# EAGLE design MySens-GWeasyRS485-Nano-V10-004 (EAGLE 7.3.0)
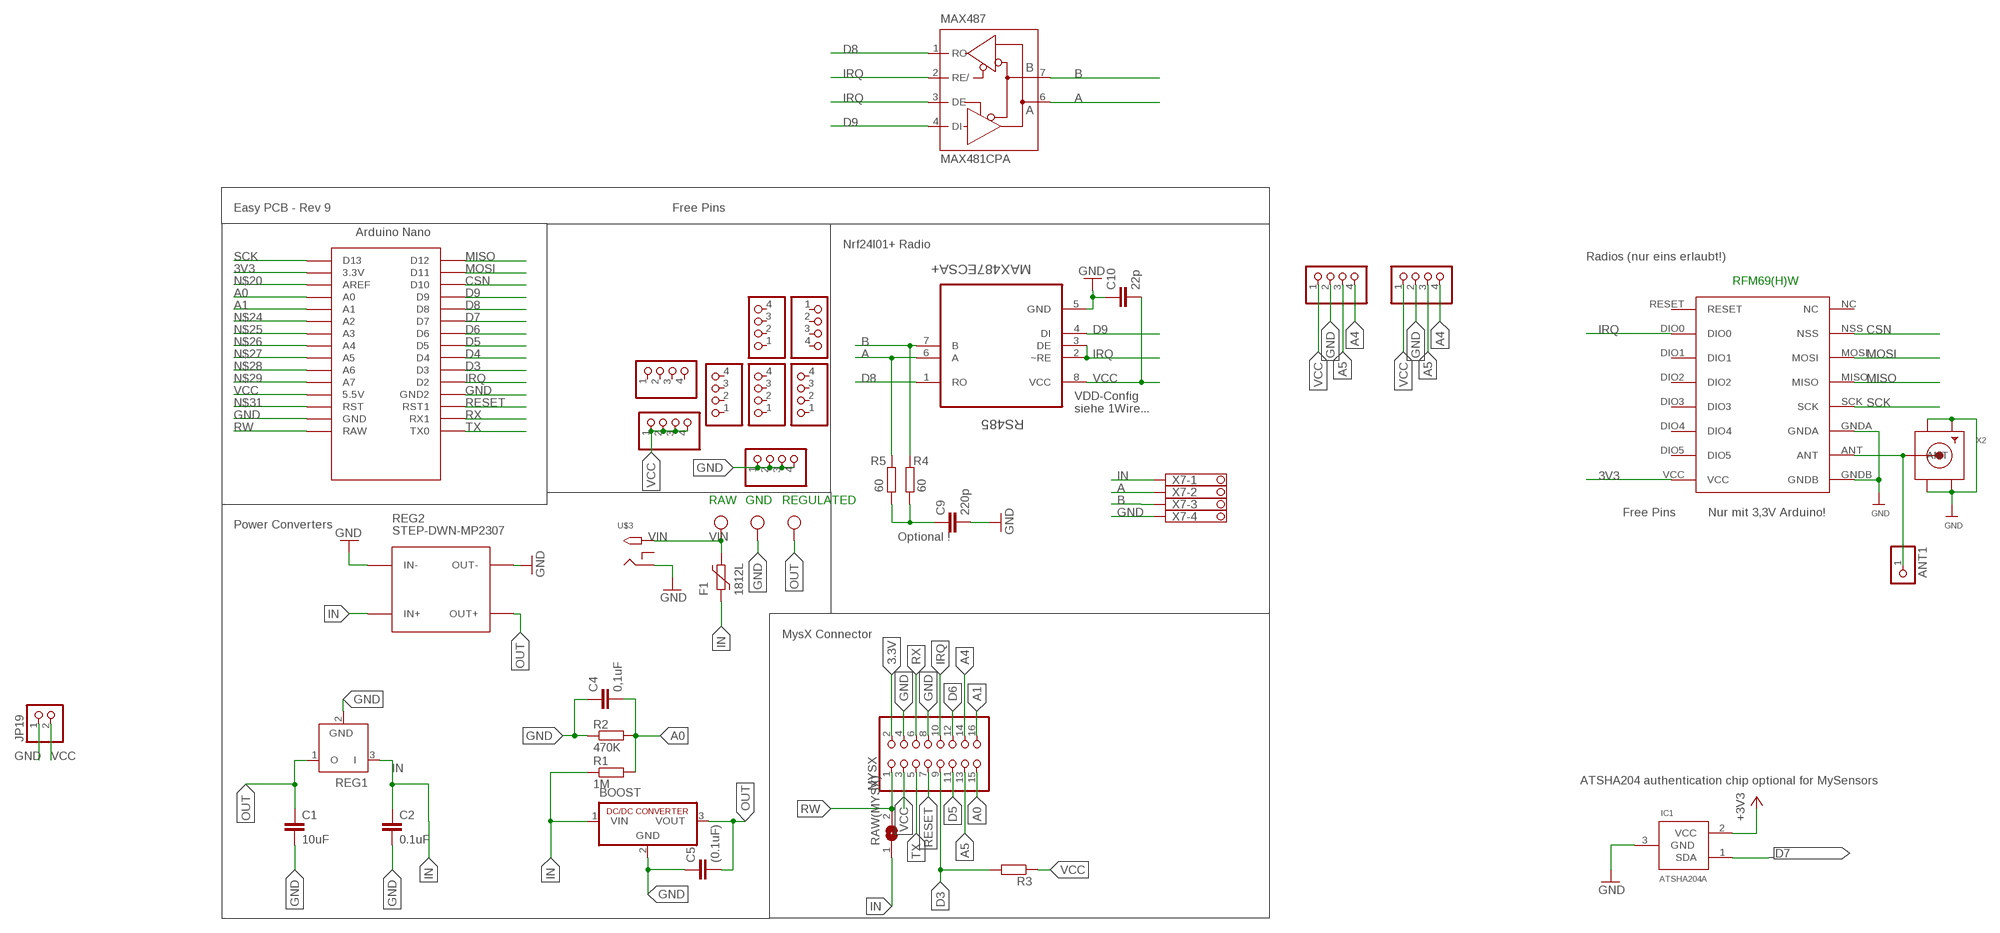
[diagram p0: schematic, sheet 1]

## Parts
ANT1  PINHD-1X1  [1X01]
BOOST  R-78C1.8-1.0  [SIP3]
C1  10uF  C-EUC1210  [C1210]
C2  0.1uF  C-EUC1206  [C1206]
C4  0,1uF  C-EUC1206  [C1206]
C5  (0.1uF)  C-EUC1206  [C1206]
C9  220p  C-EUC0805  [C0805]
C10  22p  C-EUC0805  [C0805]
F1  1812L  [1812L]
IC1  ATSHA204A  [SOT23]
JP1  PINHD-1X04_2.54-S  [1X04-S]
JP3  PINHD-1X04_2.54-S  [1X04-S]
JP6  PINHD-1X04_2.54-S  [1X04-S]
JP10  PINHD-1X04_2.54-S  [1X04-S]
JP11  PINHD-1X04_2.54-S  [1X04-S]
JP12  PINHD-1X04_2.54-S  [1X04-S]
JP13  PINHD-1X04_2.54-S  [1X04-S]
JP14  PINHD-1X04_2.54-S  [1X04-S]
JP15  PINHD-1X04_2.54-S  [1X04-S]
JP16  PINHD-1X04_2.54-S  [1X04-S]
JP19  PINHD-1X2  [1X02]
MAX487  MAX481CPA  [DIL08]
MYSX  PINHD-2X08_2.54  [2X08]
R1  1M  R-EU_R0805  [R0805]
R2  470K  R-EU_R0805  [R0805]
R3  R-EU_R0805  [R0805]
R4  60  R-EU_R0805  [R0805]
R5  60  R-EU_R0805  [R0805]
RAW(MYSX)  SJ  [SJ]
REG1  LP2950Z  [TO92]
REG2  STEP-DWN-MP2307  DC-DC-STEP-DOWN-MP2307  [DC-DC-STEP-DOWN-MP2307]
REGULATED  W237-103  [W237-103]
RFM69W  RFM69HW  [RFM]
RS485  MAX487ECSA+  [SOIC127P600X175-8N]
U$2  NANO  [NANO]
U$3  2.1MMJACKTHM  [PJ-102A]
X2  SMACONNECTOR_EDGE  [SMA_EDGELAUNCH]
X7  1751264  [1751264]

## Nets
3.3V [Power]: IC1.2(VCC) MYSX.2 ; supply symbol labelled +3V3
3V3: RFM69W.VCC U$2.3.3V
A: MAX487.6(A) R5.2 RS485.6(A) X7.2
A0: C4.2 MYSX.15 R1.2 R2.2 U$2.A0
A1: MYSX.16 U$2.A1
A4: JP6.4 JP10.4 MYSX.14
A5: JP6.3 JP10.3 MYSX.13
B: MAX487.7(B) R4.2 RS485.7(B) X7.3
CSN: RFM69W.NSS U$2.D10
D3: MYSX.9 R3.2 U$2.D3
D4: U$2.D4
D5: MYSX.11 U$2.D5
D6: MYSX.12 U$2.D6
D7: IC1.1(SDA) U$2.D7
D8: MAX487.1(RO) RS485.1(RO) U$2.D8
D9: MAX487.4(DI) RS485.4(DI) U$2.D9
GND [Power]: BOOST.2(GND) C1.2 C2.2 C4.1 C5.1 C9.2 C10.1 IC1.3(GND) JP1.1 JP1.2 JP1.3 JP1.4 JP6.2 JP10.2 JP19.1 MYSX.4 MYSX.8 R2.1 REG1.2(GND) REG2.IN- REG2.OUT- REGULATED.2 RFM69W.GNDA RFM69W.GNDB RS485.5(GND) U$2.GND U$2.GND1(GND2) U$3.RING X2.GND@1(GND4) X2.GND@2(GND3) X2.GND@3(GND2) X2.GND@4(GND1) X7.4
IN [Power]: BOOST.1(VIN) C2.1 F1.P$1 R1.1 RAW(MYSX).1 REG1.3(I) REG2.IN+ X7.1
IRQ: MAX487.2(RE/) MAX487.3(DE) MYSX.10 RFM69W.DIO0 RS485.2(~RE) RS485.3(DE) U$2.D2
MISO: RFM69W.MISO U$2.D12
MOSI: RFM69W.MOSI U$2.D11
N$16: ANT1.1 RFM69W.ANT X2.P(ANT)
N$20: U$2.AREF
N$21: C9.1 R4.1 R5.1
N$24: U$2.A2
N$25: U$2.A3
N$26: U$2.A4
N$27: U$2.A5
N$28: U$2.A6
N$29: U$2.A7
N$31: U$2.RST
OUT [Power]: BOOST.3(VOUT) C1.1 C5.2 REG1.1(O) REG2.OUT+ REGULATED.1
RESET: MYSX.7 U$2.RST1
RW: MYSX.1 RAW(MYSX).2 U$2.RAW
RX: MYSX.6 U$2.RX1
SCK: RFM69W.SCK U$2.D13
TX: MYSX.5 U$2.TX0
VCC [Power]: C10.2 JP3.1 JP3.2 JP3.3 JP3.4 JP6.1 JP10.1 JP19.2 MYSX.3 R3.1 RS485.8(VCC) U$2.5V(5.5V)
VIN [Power]: F1.P$2 REGULATED.3 U$3.TIP
Unconnected: JP11.1 JP11.2 JP11.3 JP11.4 JP12.1 JP12.2 JP12.3 JP12.4 JP13.1 JP13.2 JP13.3 JP13.4 JP14.1 JP14.2 JP14.3 JP14.4 JP15.1 JP15.2 JP15.3 JP15.4 JP16.1 JP16.2 JP16.3 JP16.4 RFM69W.DIO1 RFM69W.DIO2 RFM69W.DIO3 RFM69W.DIO4 RFM69W.DIO5 RFM69W.NC RFM69W.RESET U$2.ICSP1 U$2.ICSP2 U$2.ICSP3 U$2.ICSP4 U$2.ICSP5 U$2.ICSP6 U$3.RING_SW

## Notes on the sheet
- Easy PCB - Rev 9 | Free Pins
- Nrf24l01+ Radio
- Radios (nur eins erlaubt!)
- RFM69(H)W
- VDD-Config
  siehe 1Wire...
- RAW | GND | REGULATED
- Free Pins | Nur mit 3,3V Arduino!
- Power Converters
- Optional !
- MysX Connector
- ATSHA204 authentication chip optional for MySensors

## Power pins joined to a net without a drawn wire
GND: MAX487.5(GND)
VCC: MAX487.8(VCC)

## Library data of the parts
ANT1 = pinhead:PINHD-1X1: PIN HEADER
BOOST = dc-dc-converter:R-78C*-1.0: INNOLINE DC/DC-Converter 1.0 AMP SIP3 Single Output Source: Data sheet <http://www.mikrocontroller.net/attachment/150645/157764-da-01-en-DC_DC_WANDLER_R_78C5_0_1_0.pdf>
C1 C2 C4 C5 C9 C10 = rcl:C-EU: CAPACITOR, European symbol
F1 = ptc-littlefuse:1812L
IC1 = Sensor:ATSHA204A
JP1 JP3 JP6 JP10-JP16 = pinhead-2:PINHD-1X04: PIN HEADER
JP19 = pinhead:PINHD-1X2: PIN HEADER
MAX487 = maxim-4:MAX481CPA: RS485 TRANSEIVER
MYSX = pinhead-2:PINHD-2X08: PIN HEADER
R1-R5 = rcl:R-EU_: RESISTOR, European symbol
RAW(MYSX) = jumper:SJ: SMD solder JUMPER
REG1 = linear:LP2950: 100 mA, Low Power Low Dropout Voltage Regulator Source: http://www.onsemi.com/pub/Collateral/LP2950-D.PDF
REG2 = diy-modules:DC-DC-STEP-DOWN-MP2307: DC/DC Step-Down Regulator based on MP2307DN chip MP2307 datasheet available here: https://cdn-shop.adafruit.com/datasheets/MP2307_r1.9.pdf Click here to find device on ebay.com <http://www.ebay.com/sch/dc+dc+3a+mini+converter>
REGULATED = con-wago-500:W237-103: WAGO SCREW CLAMP; MPN: 237-103; OC_FARNELL: unknown; OC_NEWARK: 18M7116
RFM69W = hoperf:RFM69HW
RS485 = Maxim_By_element14_Batch_1:MAX487ECSA+: Low-Power, Slew-Rate-Limited RS-485/RS-422 Transceivers; MPN: MAX487ECSA+; OC_FARNELL: 9724532; OC_NEWARK: 68K4803; PACKAGE: SOIC-8; SUPPLIER: Maxim
U$2 = Arduino-clone:NANO: Arduino Nano
U$3 = adafruit:2.1MMJACK: 2.1mm x 5.5mm THM DC jack with internal switch. Digikey part #PJ-102A, 4UCON part #05537 2.1mm x 5.5mm SMT DC jack with internal switch. Digikey part #PJ-002A-SMT, 4UCON part #03267 By microbuilder.eu & adafruit.com
X2 = adafruit:SMACONNECTOR: SMA Connector 90° DIP SMA Connector, 50 Ohm (4UConnector: 07259)
X7 = con-phoenix-350:1751264: MKDS 1/ 4-3,5 Printklemme Nennstrom: 10 A Bemessungsspannung: 160 V Raster: 3,5 mm Polzahl: 4 Montageart: Löten Anschlussart: Schraubanschluss Anschlussrichtung vom Leiter zur Platine: 0° Source: http://eshop.phoenixcontact.com .. 1751264.pdf; MPN: 1751264; OC_FARNELL: unknown; OC_NEWARK: 10R0934

## Net classes
0 default: width 0.305 mm
1 Power: width 0.508 mm

## Board
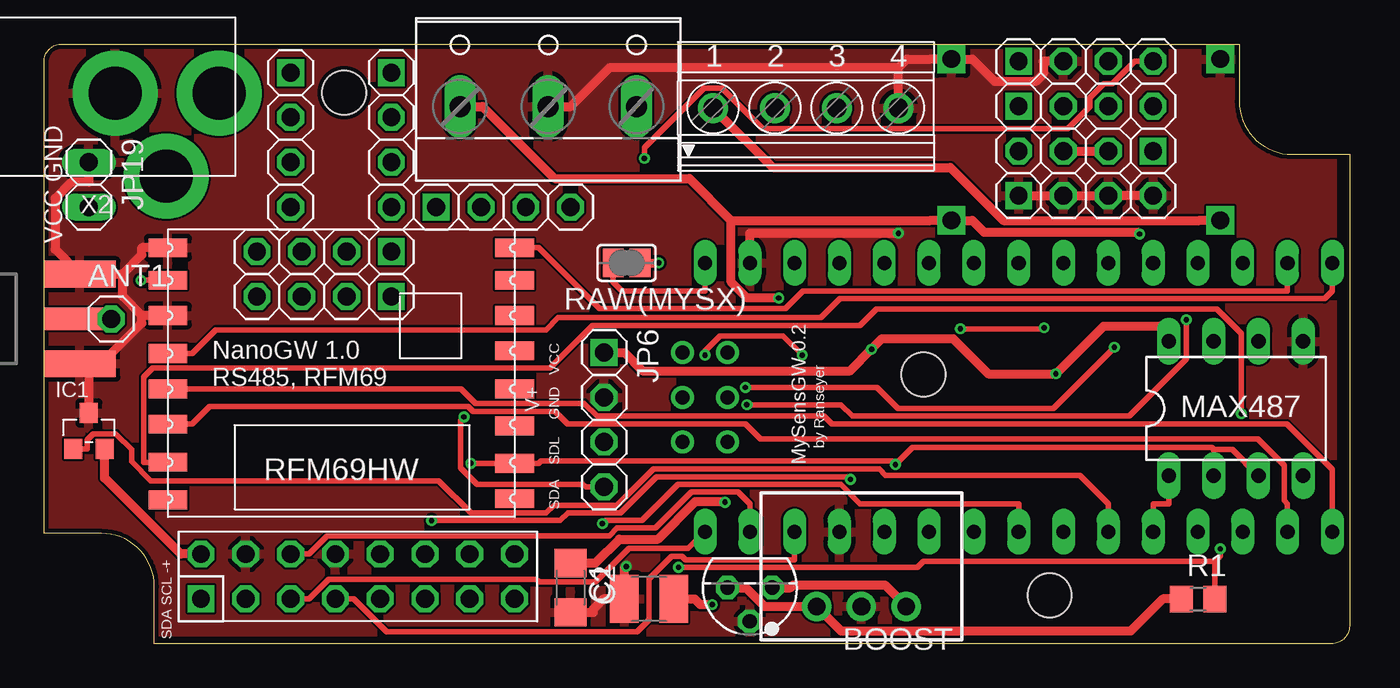
[diagram p1: board, top side]
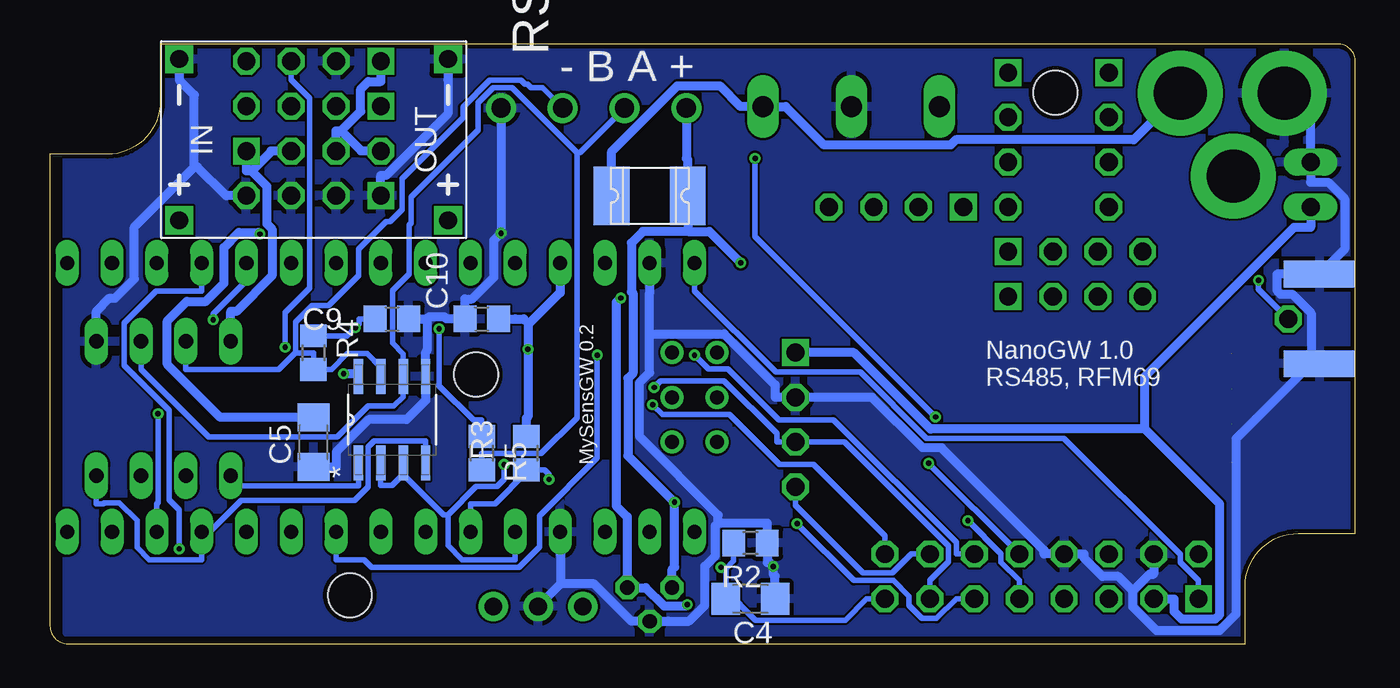
[diagram p2: board, bottom side, seen from below]

Size 74 x 34 mm. Coordinates in mm from the lower left corner, seen from the top.
Outline: 0,6.25 0,33 arc-90 1,34 67.75,34 67.75,30.75 arc90 70.75,27.75 74,27.75 74,1 arc-90 73,0 6.25,0 6.25,3.25 arc90 3.25,6.25 0,6.25
Copper layers (1*16): Top 0.035mm / dielectric 1.5mm / Bottom 0.035mm
Design rules "dirt_cheap_dirty_boards.v1": minimum track width 5mil, minimum drill 12mil, track to track 5mil, track to pad 5mil, pad to pad 5mil, via to via 5mil, smd to smd 0mil, copper to edge 10mil, drill to drill 10mil, minimum pad ring 10mil, minimum via ring 6mil, stop-mask expansion 2mil, vias tented up to drill 25mil, thermal gap 10mil
Holes 2.5 mm at 49.85,15.27 57,2.75 17,31.25

### Footprints (pad centres in the part's own frame; a part is rotated, then mirrored left to right if it is on the bottom)
1X01 = drill 1.016 octagon: 1 0,0
SIP3 = drill 1 pad 1.676: 1 -2.54,0; 2 0,0; 3 2.54,0
C1210 = smd 1.6 x 2.7: 1 -1.4,0; 2 1.4,0
C1206 = smd 1.6 x 1.8: 1 -1.4,0; 2 1.4,0
C0805 = smd 1.3 x 1.5: 1 -0.95,0; 2 0.95,0
1812L = smd 2.03 x 3.3: P$1 -2.16,0; P$2 2.16,0
SOT23 = smd 1.016 x 1.143: 1 -0.889,-1.016; 2 0.889,-1.016; 3 0,1.016
1X04-S = drill 1.016 square: 1 -3.81,0 | drill 1.016 octagon: 2 -1.27,0; 3 1.27,0; 4 3.81,0
1X02 = drill 1.016 long: 1 -1.27,0; 2 1.27,0
DIL08 = drill 0.813 long: 1 -3.81,-3.81; 2 -1.27,-3.81; 3 1.27,-3.81; 4 3.81,-3.81; 5 3.81,3.81; 6 1.27,3.81; 7 -1.27,3.81; 8 -3.81,3.81
2X08 = drill 1.016 square: 1 -8.89,-1.27 | drill 1.016 octagon: 2 -8.89,1.27; 3 -6.35,-1.27; 4 -6.35,1.27; 5 -3.81,-1.27; 6 -3.81,1.27; 7 -1.27,-1.27; 8 -1.27,1.27; 9 1.27,-1.27; 10 1.27,1.27; 11 3.81,-1.27; 12 3.81,1.27; 13 6.35,-1.27; 14 6.35,1.27; 15 8.89,-1.27; 16 8.89,1.27
R0805 = smd 1.3 x 1.5: 1 -0.95,0; 2 0.95,0
SJ = smd 1.168 x 1.6: 1 -0.762,0; 2 0.762,0
TO92 = drill 0.813 octagon: 1 -1.27,0; 2 0,1.905; 3 1.27,0
DC-DC-STEP-DOWN-MP2307 = drill 1 pad 1.6 square: IN+ -7.62,-4.572; IN- -7.62,4.572; OUT+ 7.62,-4.572; OUT- 7.62,4.572
W237-103 = drill 1.194 long: 1 -5,-1.29; 2 0,-1.29; 3 5,-1.29
RFM = smd 2.184 x 1.067: ANT 19.651,2.889; DIO0 0,13.27; DIO1 0,11.143; DIO2 0,9.047; DIO3 0,6.889; DIO4 0,4.889; DIO5 0,2.889; GNDA 19.651,4.889; GNDB 19.651,1.048; MISO 19.651,9.047; MOSI 19.651,11.047; NC 19.651,15.334; NSS 19.651,13.206; RESET 0,15.27; SCK 19.651,7.048; VCC 0,1.048
SOIC127P600X175-8N = smd 1.981 x 0.533: 1 -2.464,1.905; 2 -2.464,0.635; 3 -2.464,-0.635; 4 -2.464,-1.905; 5 2.464,-1.905; 6 2.464,-0.635; 7 2.464,0.635; 8 2.464,1.905
NANO = drill 0.8 long: 3.3V -10.16,24.13; 5V -10.16,-1.27; A0 -10.16,19.05; A1 -10.16,16.51; A2 -10.16,13.97; A3 -10.16,11.43; A4 -10.16,8.89; A5 -10.16,6.35; A6 -10.16,3.81; A7 -10.16,1.27; AREF -10.16,21.59; D2 5.08,1.27; D3 5.08,3.81; D4 5.08,6.35; D5 5.08,8.89; D6 5.08,11.43; D7 5.08,13.97; D8 5.08,16.51; D9 5.08,19.05; D10 5.08,21.59; D11 5.08,24.13; D12 5.08,26.67; D13 -10.16,26.67; GND -10.16,-6.35; GND1 5.08,-1.27; RAW -10.16,-8.89; RST -10.16,-3.81; RST1 5.08,-3.81; RX1 5.08,-6.35; TX0 5.08,-8.89 | drill 0.8: ICSP1 -5.08,-10.16; ICSP2 -5.08,-7.62; ICSP3 -2.54,-10.16; ICSP4 -2.54,-7.62; ICSP5 0,-10.16; ICSP6 0,-7.62
PJ-102A = drill 3 pad 4.8: RING 0.1,-3.39; RING_SW -4.6,-6.29; TIP 0.1,-9.29
SMA_EDGELAUNCH = smd 4.064 x 1.524: GND@1 2.032,-2.54; GND@2 2.032,2.54 | smd 4.064 x 1.524 bottom: GND@3 2.032,2.54; GND@4 2.032,-2.54 | smd 4.064 x 1.27: P 2.032,0
1751264 = drill 1.1 pad 1.7: 1 -5.25,-0.1; 2 -1.75,-0.1; 3 1.75,-0.1; 4 5.25,-0.1

### Placement (x,y rotation side)
ANT1  3.81,18.41 0 top
BOOST  46.33,2.11 0 top
C1  34.29,2.54 180 top
C2  29.84,3.17 270 top
C4  34.29,2.54 180 bottom
C5  59.05,11.43 90 bottom
C9  54.61,18.41 0 bottom
C10  49.53,18.41 0 bottom
F1  40.01,25.4 180 bottom
IC1  2.54,12.06 0 top
JP1  59.05,25.4 0 top
JP3  59.05,27.94 180 top
JP6  31.75,12.7 270 top
JP10  59.05,33.02 0 top
JP11  15.88,19.68 180 top
JP12  13.97,28.57 270 top
JP13  15.88,22.23 180 top
JP14  26.04,24.77 0 top
JP15  59.05,30.48 0 top
JP16  19.68,28.57 270 top
JP19  2.54,26.04 270 top
MAX487  67.56,13.34 0 top
MYSX  17.78,3.81 0 top
R1  65.41,2.54 0 top
R2  34.29,5.71 180 bottom
R3  46.99,10.79 270 bottom
R4  59.05,16.51 270 bottom
R5  49.53,10.79 270 bottom
RAW(MYSX)  33.02,21.59 180 top
REG1  40.01,3.17 180 top
REG2  59.05,28.57 0 bottom
REGULATED  28.57,31.75 0 top
RFM69W  26.67,23.5 180 top
RS485  54.61,12.7 90 bottom
U$2  46.35,11.43 270 top
U$3  0.64,31.11 90 top
X2  0,18.41 0 top
X7  43.18,30.48 0 top

### Tracks (layer width: path | path; a pad name or v marks a point on that pad's centre or on a via)
3.3V
  Top 0.508: MYSX.2 7.75,5.08 3.43,9.4 IC1.2
3V3
  Top 0.305: RFM69W.VCC 28.04,22.45 31.47,19.02 42.02,19.02 43.01,20 70.48,20 U$2.3.3V
A
  Bottom 0.305: 44.13,27.86 47.8,31.52 48.89,31.52 49.73,30.69 49.73,29.13 53.52,25.33 53.52,23.85 53.64,23.73 53.64,20.96 54.59,20.01 54.59,17.05 53.98,16.43 RS485.6 53.98,14 54.51,13.47 55.98,13.47 57.72,11.73 65.02,11.73 68.83,15.54 MAX487.6 | X7.2 43.95,27.86 44.13,27.86 | 44.13,27.86 44.13,12.79 46.15,10.77 49.53,10.77 R5.2
A0  (via drill 0.3 pad 0.61)
  Top 0.305: 66.36,4.66 49.85,4.66 49.52,4.33 v35.96,4.33 | v66.67,5.38 66.67,4.98 66.36,4.66 | 66.36,4.66 66.36,3.57 R1.2
  Bottom 0.305: v66.67,5.38 66.67,7.59 67.23,8.15 67.23,13.22 69.79,15.78 69.79,18.19 67.98,20 65.41,20 U$2.A0 | 35.69,3.02 34,1.33 28.92,1.33 27.71,2.54 MYSX.15 | 35.69,4.24 35.69,3.72 35.69,3.02 | 35.69,4.24 35.24,4.69 R2.2 | v35.96,4.33 35.78,4.33 35.69,4.24 | C4.2 35.69,3.02
A1  (via drill 0.3 pad 0.61)
  Top 0.305: v39.84,13.55 45.18,13.55 45.82,12.91 61.51,12.91 64.75,16.14 v64.75,18.37
  Bottom 0.305: U$2.A1 62.87,20.57 64.75,18.69 v64.75,18.37 | v39.84,13.55 39.29,12.99 35.47,12.99 32.64,10.16 30.71,10.16 26.67,6.12 MYSX.16
A4  (via drill 0.3 pad 0.61)
  Top 0.305: JP6.4 30.71,8.89 30.56,9.04 24.54,9.04 23.61,9.96 23.61,12.66 v23.8,12.86 | JP10.4 61.82,33.02 60.55,31.75 60.08,31.75 59.28,30.95 59.28,30.46 58.03,29.21 40.74,29.21 38.44,31.51 37.41,31.51 34.03,28.13 v34.03,27.51
  Bottom 0.305: v23.8,12.86 34.03,23.08 v34.03,27.51 | JP6.4 31.75,7.85 27.92,4.02 26.24,4.02 25.17,5.08 MYSX.14
A5  (via drill 0.3 pad 0.61)
  Top 0.305: v39.75,14.53 47.21,14.53 48.4,13.34 57.2,13.34 v60.67,16.81
  Bottom 0.305: JP10.3 60.33,31.98 59.28,30.94 59.28,20.15 60.67,18.77 v60.67,16.81 | v39.75,14.53 39.38,14.9 35.78,14.9 32.79,11.91 32.79,11.43 JP6.3 31.63,11.43 30.71,11.43 28.96,11.43 23.08,5.55 23.08,4.63 24.13,3.58 MYSX.13
B
  Bottom 0.305: 60.03,16.54 60.09,16.59 60.09,18.24 59.15,19.17 58.21,19.17 56.52,20.87 56.52,22.37 54.94,23.95 54.71,23.95 54.04,24.62 54.04,26.38 50.59,29.82 50.59,30.44 49.07,31.96 47.3,31.96 47.07,31.73 46.92,31.73 46.72,31.52 46.07,31.52 X7.3 | 60.03,16.54 59.98,16.49 59.05,16.49 R4.2 58.54,15.56 58.03,15.56 57.15,16.44 56.01,16.44 55.24,15.67 55.24,15.53 RS485.7 | 60.03,16.54 61.03,15.54 66.29,15.54 MAX487.7
CSN  (via drill 0.3 pad 0.61)  (1 unrouted)
  Top 0.305: RFM69W.NSS 5.65,10.29 5.65,15.13 6.15,15.63 28.68,15.63 31.1,18.05 46.26,18.05 47.19,18.99 66.47,18.99 67.87,17.59 v67.87,13.04
  Bottom 0.305: U$2.D10 67.94,7.94 67.87,8.01 v67.87,13.04
D3  (via drill 0.3 pad 0.61)
  Top 0.305: v21.97,6.98 29.26,6.98 29.7,7.42 32.67,7.42 34.72,9.47 45.56,9.47 v45.71,9.31
  Bottom 0.305: v45.71,9.31 45.71,9.6 45.96,9.85 R3.2 46.99,9.73 48.78,7.94 50.16,7.94 U$2.D3 | v21.97,6.98 20.09,5.1 20.09,4.62 19.05,3.58 MYSX.9
D5  (via drill 0.3 pad 0.61)
  Top 0.305: v31.65,6.81 31.83,6.98 33.88,6.98 35.93,9.03 45.16,9.03 46.26,7.94 55.24,7.94 U$2.D5
  Bottom 0.305: v31.65,6.81 28.43,3.58 26.18,3.58 25.3,2.7 25.3,2.17 24.56,1.43 23.74,1.43 22.63,2.54 MYSX.11
D6  (via drill 0.3 pad 0.61)
  Top 0.305: v42.98,16.36 41.89,17.45 38.32,17.45 37.47,16.59 v37.47,16.36
  Bottom 0.305: U$2.D6 57.78,4.76 56.2,4.76 55.76,4.33 47.42,4.33 46.26,5.48 46.26,7.25 42.98,10.53 v42.98,16.36 | MYSX.12 22.63,5.08 22.63,5.74 29.59,12.7 32.68,12.7 35.55,15.58 36.68,15.58 v37.47,16.36
D7
  Top 0.305: IC1.1 2.44,11.05 2.44,11.54 2.8,11.9 4.07,11.9 4.95,11.01 4.95,10.32 6.04,9.24 22.37,9.24 24.2,7.41 28.46,7.41 28.9,7.85 32.49,7.85 34.54,9.9 47.35,9.9 47.7,9.54 58.72,9.54 60.33,7.94 U$2.D7
D8
  Top 0.305: U$2.D8 62.87,7.94 63.25,7.94 63.26,7.92 63.75,7.92 MAX487.1
  Bottom 0.305: RS485.1 56.52,8.97 56.53,8.95 63.18,8.95 MAX487.1
D9
  Bottom 0.305: RS485.4 52.7,11.51 55.63,11.51 55.97,11.17 55.97,8.9 56.74,8.13 63.16,8.13 65.38,5.91 65.41,5.91 | 65.41,5.91 65.41,4.76 68.38,4.76 69.06,5.45 69.06,6.98 70.07,7.99 70.92,7.99 70.98,7.92 71.37,7.92 MAX487.4 | U$2.D9 65.41,5.91
GND  (via drill 0.3 pad 0.61)
  Top 0.508: JP19.1 2.54,26.16 1.54,26.16 0.62,25.24 0.62,22.36 X2.GND@2 4.45,20.95 | 5.54,18.61 4.45,19.71 4.45,20.95 | 3.24,15.88 5.54,18.18 5.54,18.61 | RFM69W.GNDB 5.54,22.45 5.54,22.05 4.45,20.95 | JP1.1 JP1.2 JP1.3 JP1.4 | 3.24,15.88 2.54,15.18 IC1.3 | X2.GND@1 3.24,15.88 | v33.01,4.38 32.9,4.27 32.89,4.27 C4.1 32.3,2.54 32.15,2.54 31.71,2.54 31.13,1.96 31.13,1.77 C2.2 | 48.43,32.66 48.92,33.15 50.25,33.15 REG2.OUT- 52.62,33.15 53.89,31.88 56.21,31.88 56.64,32.31 56.64,33.02 JP10.2 | X7.4 48.43,32.66 | 48.43,32.66 32.05,32.66 29.85,30.46 REGULATED.2 | v48.43,23.28 40.01,23.28 U$2.GND | RFM69W.GNDA 5.54,18.61
  Bottom 0.508: 52.63,18.41 52.5,18.54 51.64,18.54 51.51,18.41 C10.1 50.48,19.55 50.07,19.55 48.83,20.79 48.83,22.88 v48.43,23.28 X7.4 | C5.1 57.77,10.03 57.77,10.86 55.93,12.71 53.78,12.71 52.7,13.79 RS485.5 52.7,15.45 52.7,16.54 52.63,16.61 52.63,18.41 | 65.81,27.03 69.22,23.63 69.22,20.68 70.31,19.59 70.63,19.59 71.37,18.85 MAX487.5 | 40.01,17.57 40.01,19.9 U$2.GND | 36.12,6.85 36.12,7.28 40.58,11.74 40.58,14.8 40.01,15.38 40.01,17.57 | 40.01,17.57 35.79,17.57 32.89,14.67 32.89,13.97 JP6.2 27.4,13.97 24.53,11.1 23.45,11.1 17.65,5.3 17.65,5.08 MYSX.8 15.37,5.08 15.37,4.84 14.33,3.81 13.45,3.81 12.62,2.98 | 33.34,6.85 R2.1 33.34,4.58 33.21,4.58 v33.01,4.38 33.01,3.94 32.89,3.82 C4.1 | 36.12,6.85 36.27,6.69 36.27,4.99 36.87,4.39 36.87,2.19 37.79,1.27 38.96,1.27 39.48,1.27 REG1.2 41.05,1.27 43.16,3.38 45.06,3.38 | 36.12,6.85 33.34,6.85 | 33.34,6.85 | 2.51,15.88 2.51,18.74 3.58,19.81 4.23,19.81 4.45,20.03 4.45,20.95 X2.GND@2 0.61,22.37 0.61,25.23 1.54,26.16 2.54,26.16 JP19.1 2.54,29.73 U$3.RING | REG2.IN- 66.67,31.97 65.81,31.1 65.81,27.03 | JP1.4 64.01,25.4 65.64,27.03 65.81,27.03 | JP1.1 55.24,26.54 54.96,26.54 51.44,30.07 51.44,31.97 REG2.OUT- | 12.62,2.98 11.67,3.94 11.43,3.94 MYSX.4 | 2.51,15.88 6.77,11.62 6.77,1.68 7.71,0.73 11.26,0.73 12.62,2.09 12.62,2.98 | X2.GND@1 2.51,15.88 | C9.2 52.63,18.41 | 45.06,3.38 BOOST.2 | 45.06,3.38 45.06,5.02 45.09,5.05 U$2.GND1
  pour Top: 0,0.64 0,34.29 73.03,34.29 73.03,0.64
  pour Bottom: 0,34.29 0,0.64 73.03,0.64 73.03,34.29
IN  (via drill 0.3 pad 0.61)
  Top 0.508: v38.6,8.02 38.56,8.05 36.92,8.05 34.79,5.93 32.61,5.93 31.26,4.58 31.13,4.58 C2.1 | R1.1 63.42,2.54 61.6,0.72 45.18,0.72 BOOST.1 40.84,2.11 39.78,3.17 REG1.3 | X7.1 41.3,27.01 51.37,27.01 54.37,24 65.49,24 REG2.IN+ | v34.84,21.59 34.75,21.59 RAW(MYSX).1
  Bottom 0.508: 37.84,23.37 40.4,23.37 41.04,22.72 41.04,19.96 40.96,19.88 40.96,15.32 41.24,15.04 41.24,10.66 v38.6,8.02 38.6,4.36 38.73,4.22 REG1.3 | X7.1 37.93,27.52 37.84,27.43 F1.P$1 37.84,23.37 | 37.84,23.37 36.62,23.37 v34.84,21.59
IRQ  (via drill 0.3 pad 0.61)
  Top 0.305: MAX487.3 67.34,11.02 66.29,11.02 | 66.29,11.02 66.19,11.12 49.23,11.12 v48.26,10.16 48.06,10.35 28.17,10.35 28.04,10.22 RFM69W.DIO0 v24.2,10.22 | MAX487.2 66.29,11.02
  Bottom 0.305: 51.44,7.32 49.84,8.91 48.66,8.91 48.26,9.32 v48.26,10.16 | 51.44,7.32 51.44,5.57 50.63,4.76 47.62,4.76 U$2.D2 | 51.44,7.32 51.69,7.32 53.98,9.6 | RS485.2 55.24,8.97 54.61,8.97 53.98,9.6 | RS485.3 53.98,9.6 | MYSX.10 v24.2,10.22
MISO  (1 unrouted)
  Top 0.305: U$2.D12 73.03,9.88 70.46,12.45 44.67,12.45 44.22,12.9 31.34,12.9 30.61,13.63 24.46,13.63 23.65,14.45 8.39,14.45 RFM69W.MISO
MOSI  (1 unrouted)
  Top 0.305: RFM69W.MOSI 8.39,12.45 9.38,13.44 24.04,13.44 24.32,13.16 28.97,13.16 29.66,12.47 39.75,12.47 40.61,11.61 68.79,11.61 70.3,10.1 70.3,8.12 70.48,7.94 U$2.D11
N$16  (via drill 0.3 pad 0.61)  (1 unrouted)
  Top 0.305: v5.49,20.61 5.65,20.61 RFM69W.ANT | X2.P ANT1.1
  Bottom 0.305: ANT1.1 5.49,20.1 v5.49,20.61
N$21  (via drill 0.3 pad 0.61)
  Top 0.305: v51.94,17.86 56.63,17.86 v56.69,17.92
  Bottom 0.305: R4.1 57.15,17.46 v56.69,17.92 56.49,18.12 56.49,18.41 C9.1 | R5.1 49.53,12.68 49.99,12.68 51.94,14.62 v51.94,17.86
OUT  (via drill 0.3 pad 0.61)
  Top 0.508: v41.65,19.6 39.86,19.6 38.94,20.52 38.94,24 | 38.94,24 50.25,24 REG2.OUT+ 52.62,24 53.3,23.32 62,23.32 v62.1,23.22 | 38.94,24 36.57,26.37 28.94,26.37 24.85,30.46 REGULATED.1 | REG1.1 42.32,3.17 42.47,3.33 47.65,3.33 BOOST.3 | C1.1 36.87,2.54 37.2,2.21 v37.88,2.21
  Bottom 0.508: v41.65,19.6 41.9,19.35 41.9,7.82 41.27,7.2 REG1.1 40.23,3.17 39.19,2.13 37.96,2.13 v37.88,2.21 | C5.2 64.34,12.83 67.35,15.84 67.35,18.3 66.25,19.4 65.17,19.4 64.14,20.44 64.14,22.47 63.29,23.32 62.19,23.32 v62.1,23.22
RESET
  Top 0.305: MYSX.7 17.55,2.54 19.41,0.68 33.61,0.68 34.29,1.36 34.29,3.69 35.56,4.96 36.16,4.96 36.36,4.76 42.55,4.76 U$2.RST1
RW
  Top 0.305: RAW(MYSX).2 32.26,20.51 32.77,20 37.47,20 U$2.RAW
  Bottom 0.305: MYSX.1 8.89,3.58 9.93,4.62 9.93,5.05 16.51,11.63 24.31,11.63 28.07,15.39 32.85,15.39 37.47,20 U$2.RAW
RX
  Top 0.305: MYSX.6 15.01,5.08 16.05,6.12 32.05,6.12 32.48,6.55 34.66,6.55 36.71,8.6 39.34,8.6 40.01,7.94 U$2.RX1
SCK  (1 unrouted)
  Top 0.305: RFM69W.SCK 8.39,16.45 9.74,17.79 28.45,17.79 29.14,18.49 44.04,18.49 45.12,19.57 72.59,19.57 73.03,20 U$2.D13
TX
  Top 0.305: U$2.TX0 36.51,5.39 33.17,5.39 31.27,3.5 28.08,3.5 27.92,3.65 16.12,3.65 15.01,2.54 MYSX.5
VCC  (via drill 0.3 pad 0.61)
  Top 0.508: JP6.1 32.89,16.51 33.93,15.47 45.68,15.47 v46.9,16.7 47.5,17.3 51.53,17.3 53.52,15.3 v57.35,15.3 60.05,18 63.75,18 MAX487.8 | JP3.3 JP3.2
  Bottom 0.508: 11.95,12.17 11.95,15.14 3.47,23.62 2.54,23.62 JP19.2 | 11.95,12.17 7.7,7.92 7.7,1.64 7.95,1.4 9.86,1.4 10.29,1.83 10.29,2.54 MYSX.3 | 11.95,12.17 24.09,12.17 28.43,16.51 JP6.1 | 46.9,18.17 v46.9,16.7 46.9,12.86 46.99,12.78 R3.1 | 46.9,18.17 46.81,18.17 45.09,19.9 U$2.5V | 46.9,18.17 47.15,18.41 47.63,18.41 C10.2 | 62.58,26.8 61.72,25.93 61.72,23.81 61.41,23.51 61.41,20.86 63.43,18.85 63.75,18.85 MAX487.8 | 62.58,26.8 62.87,26.8 JP3.1 | 62.58,26.8 61.47,27.91 61.47,27.94 JP3.2 | 57.5,29.08 56.39,30.19 56.39,31.45 55.96,31.88 55.24,31.88 JP10.1 | 57.5,29.08 57.78,29.08 JP3.3 | 57.5,29.08 56.39,27.97 56.39,27.94 JP3.4 | RS485.8 56.65,15.3 v57.35,15.3
VIN
  Bottom 0.508: U$3.TIP 12.56,28.57 22.65,28.57 22.95,28.28 30.11,28.28 32.3,30.46 REGULATED.3 34.85,30.46 36.02,31.63 38.44,31.63 42.16,27.9 F1.P$2

### Text on the board
tPlace: by Ranseyer
tNames: VCC GND | NanoGW 1.0 / RS485, RFM69 | V+ | VCC | GND | SDL | MySensGW 0.2 | SDA | SDA SCL -+
bNames: - B A + | NanoGW 1.0 / RS485, RFM69 | MySensGW 0.2